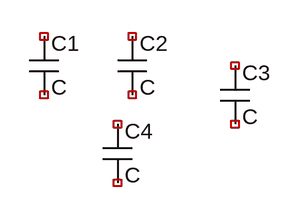
[diagram p0: schematic LTM Draft1.asc]
LTM Draft1.asc, the LTspice schematic file:
Version 4
SHEET 1 880 680
SYMBOL cap 128 112 R0
SYMATTR InstName C1
SYMBOL cap 224 112 R0
SYMATTR InstName C2
SYMBOL cap 336 144 R0
SYMATTR InstName C3
SYMBOL cap 208 208 R0
SYMATTR InstName C4

The netlist it stands for:
* LTM Draft1.asc
C1 NC_01 NC_02 C
C2 NC_03 NC_04 C
C3 NC_05 NC_06 C
C4 NC_07 NC_08 C
.backanno
.end